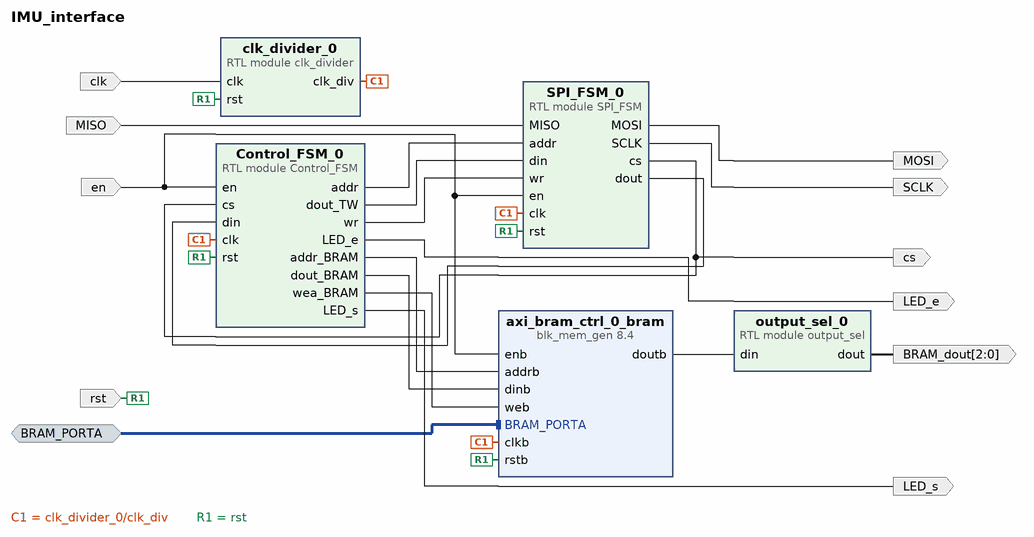
[diagram p0: block diagram of the top level]
# Vivado block design IMU_interface, xc7z020clg400-1, Vivado 2021.1
create_bd_design IMU_interface

create_bd_intf_port -mode Slave -vlnv xilinx.com:interface:bram_rtl:1.0 BRAM_PORTA
set_property -dict {CONFIG.MASTER_TYPE BRAM_CTRL CONFIG.READ_WRITE_MODE READ_WRITE} [get_bd_intf_ports BRAM_PORTA]
create_bd_port -dir O -from 2 -to 0 BRAM_dout
create_bd_port -dir O LED_e
create_bd_port -dir O LED_s
create_bd_port -dir I MISO
create_bd_port -dir O MOSI
create_bd_port -dir O SCLK
create_bd_port -dir I -type clk clk
set_property -dict {CONFIG.ASSOCIATED_RESET rst CONFIG.FREQ_HZ 125000000} [get_bd_ports clk]
create_bd_port -dir O cs
create_bd_port -dir I en
create_bd_port -dir I -type rst rst
set_property -dict {CONFIG.POLARITY ACTIVE_HIGH} [get_bd_ports rst]

create_bd_cell -type module -reference SPI_FSM SPI_FSM_0
create_bd_cell -type ip -vlnv xilinx.com:ip:blk_mem_gen:8.4 axi_bram_ctrl_0_bram
set_property -dict {CONFIG.Memory_Type True_Dual_Port_RAM} [get_bd_cells axi_bram_ctrl_0_bram]
create_bd_cell -type module -reference clk_divider clk_divider_0
create_bd_cell -type module -reference output_sel output_sel_0
create_bd_cell -type module -reference Control_FSM Control_FSM_0

# ---- connections ----

connect_bd_intf_net -intf_net axi_bram_ctrl_0_BRAM_PORTA [get_bd_intf_ports BRAM_PORTA] [get_bd_intf_pins axi_bram_ctrl_0_bram/BRAM_PORTA]
connect_bd_net [get_bd_pins Control_FSM_0/LED_e] [get_bd_ports LED_e]
connect_bd_net [get_bd_pins Control_FSM_0/LED_s] [get_bd_ports LED_s]
connect_bd_net [get_bd_pins Control_FSM_0/addr] [get_bd_pins SPI_FSM_0/addr]
connect_bd_net [get_bd_pins Control_FSM_0/addr_BRAM] [get_bd_pins axi_bram_ctrl_0_bram/addrb]
connect_bd_net [get_bd_pins Control_FSM_0/dout_BRAM] [get_bd_pins axi_bram_ctrl_0_bram/dinb]
connect_bd_net [get_bd_pins Control_FSM_0/dout_TW] [get_bd_pins SPI_FSM_0/din]
connect_bd_net [get_bd_pins Control_FSM_0/wea_BRAM] [get_bd_pins axi_bram_ctrl_0_bram/web]
connect_bd_net [get_bd_pins Control_FSM_0/wr] [get_bd_pins SPI_FSM_0/wr]
connect_bd_net [get_bd_ports MISO] [get_bd_pins SPI_FSM_0/MISO]
connect_bd_net [get_bd_pins SPI_FSM_0/MOSI] [get_bd_ports MOSI]
connect_bd_net [get_bd_pins SPI_FSM_0/SCLK] [get_bd_ports SCLK]
connect_bd_net [get_bd_pins SPI_FSM_0/cs] [get_bd_ports cs] [get_bd_pins Control_FSM_0/cs]
connect_bd_net [get_bd_pins SPI_FSM_0/dout] [get_bd_pins Control_FSM_0/din]
connect_bd_net [get_bd_pins axi_bram_ctrl_0_bram/doutb] [get_bd_pins output_sel_0/din]
connect_bd_net [get_bd_ports clk] [get_bd_pins clk_divider_0/clk]
connect_bd_net [get_bd_pins clk_divider_0/clk_div] [get_bd_pins SPI_FSM_0/clk] [get_bd_pins axi_bram_ctrl_0_bram/clkb] [get_bd_pins Control_FSM_0/clk]
connect_bd_net [get_bd_ports en] [get_bd_pins axi_bram_ctrl_0_bram/enb] [get_bd_pins SPI_FSM_0/en] [get_bd_pins Control_FSM_0/en]
connect_bd_net [get_bd_pins output_sel_0/dout] [get_bd_ports BRAM_dout]
connect_bd_net [get_bd_ports rst] \
  [get_bd_pins SPI_FSM_0/rst] [get_bd_pins axi_bram_ctrl_0_bram/rstb] [get_bd_pins clk_divider_0/rst] \
  [get_bd_pins Control_FSM_0/rst]

validate_bd_design
save_bd_design
